# EasyEDA schematic SCH_USB-HUB_2026-07-22.json
TITLE: Sheet_1; REV: 1.0; Date: 2026-06-09; Sheet: 1/1; Drawn By: yash2942012; Company: Your Company
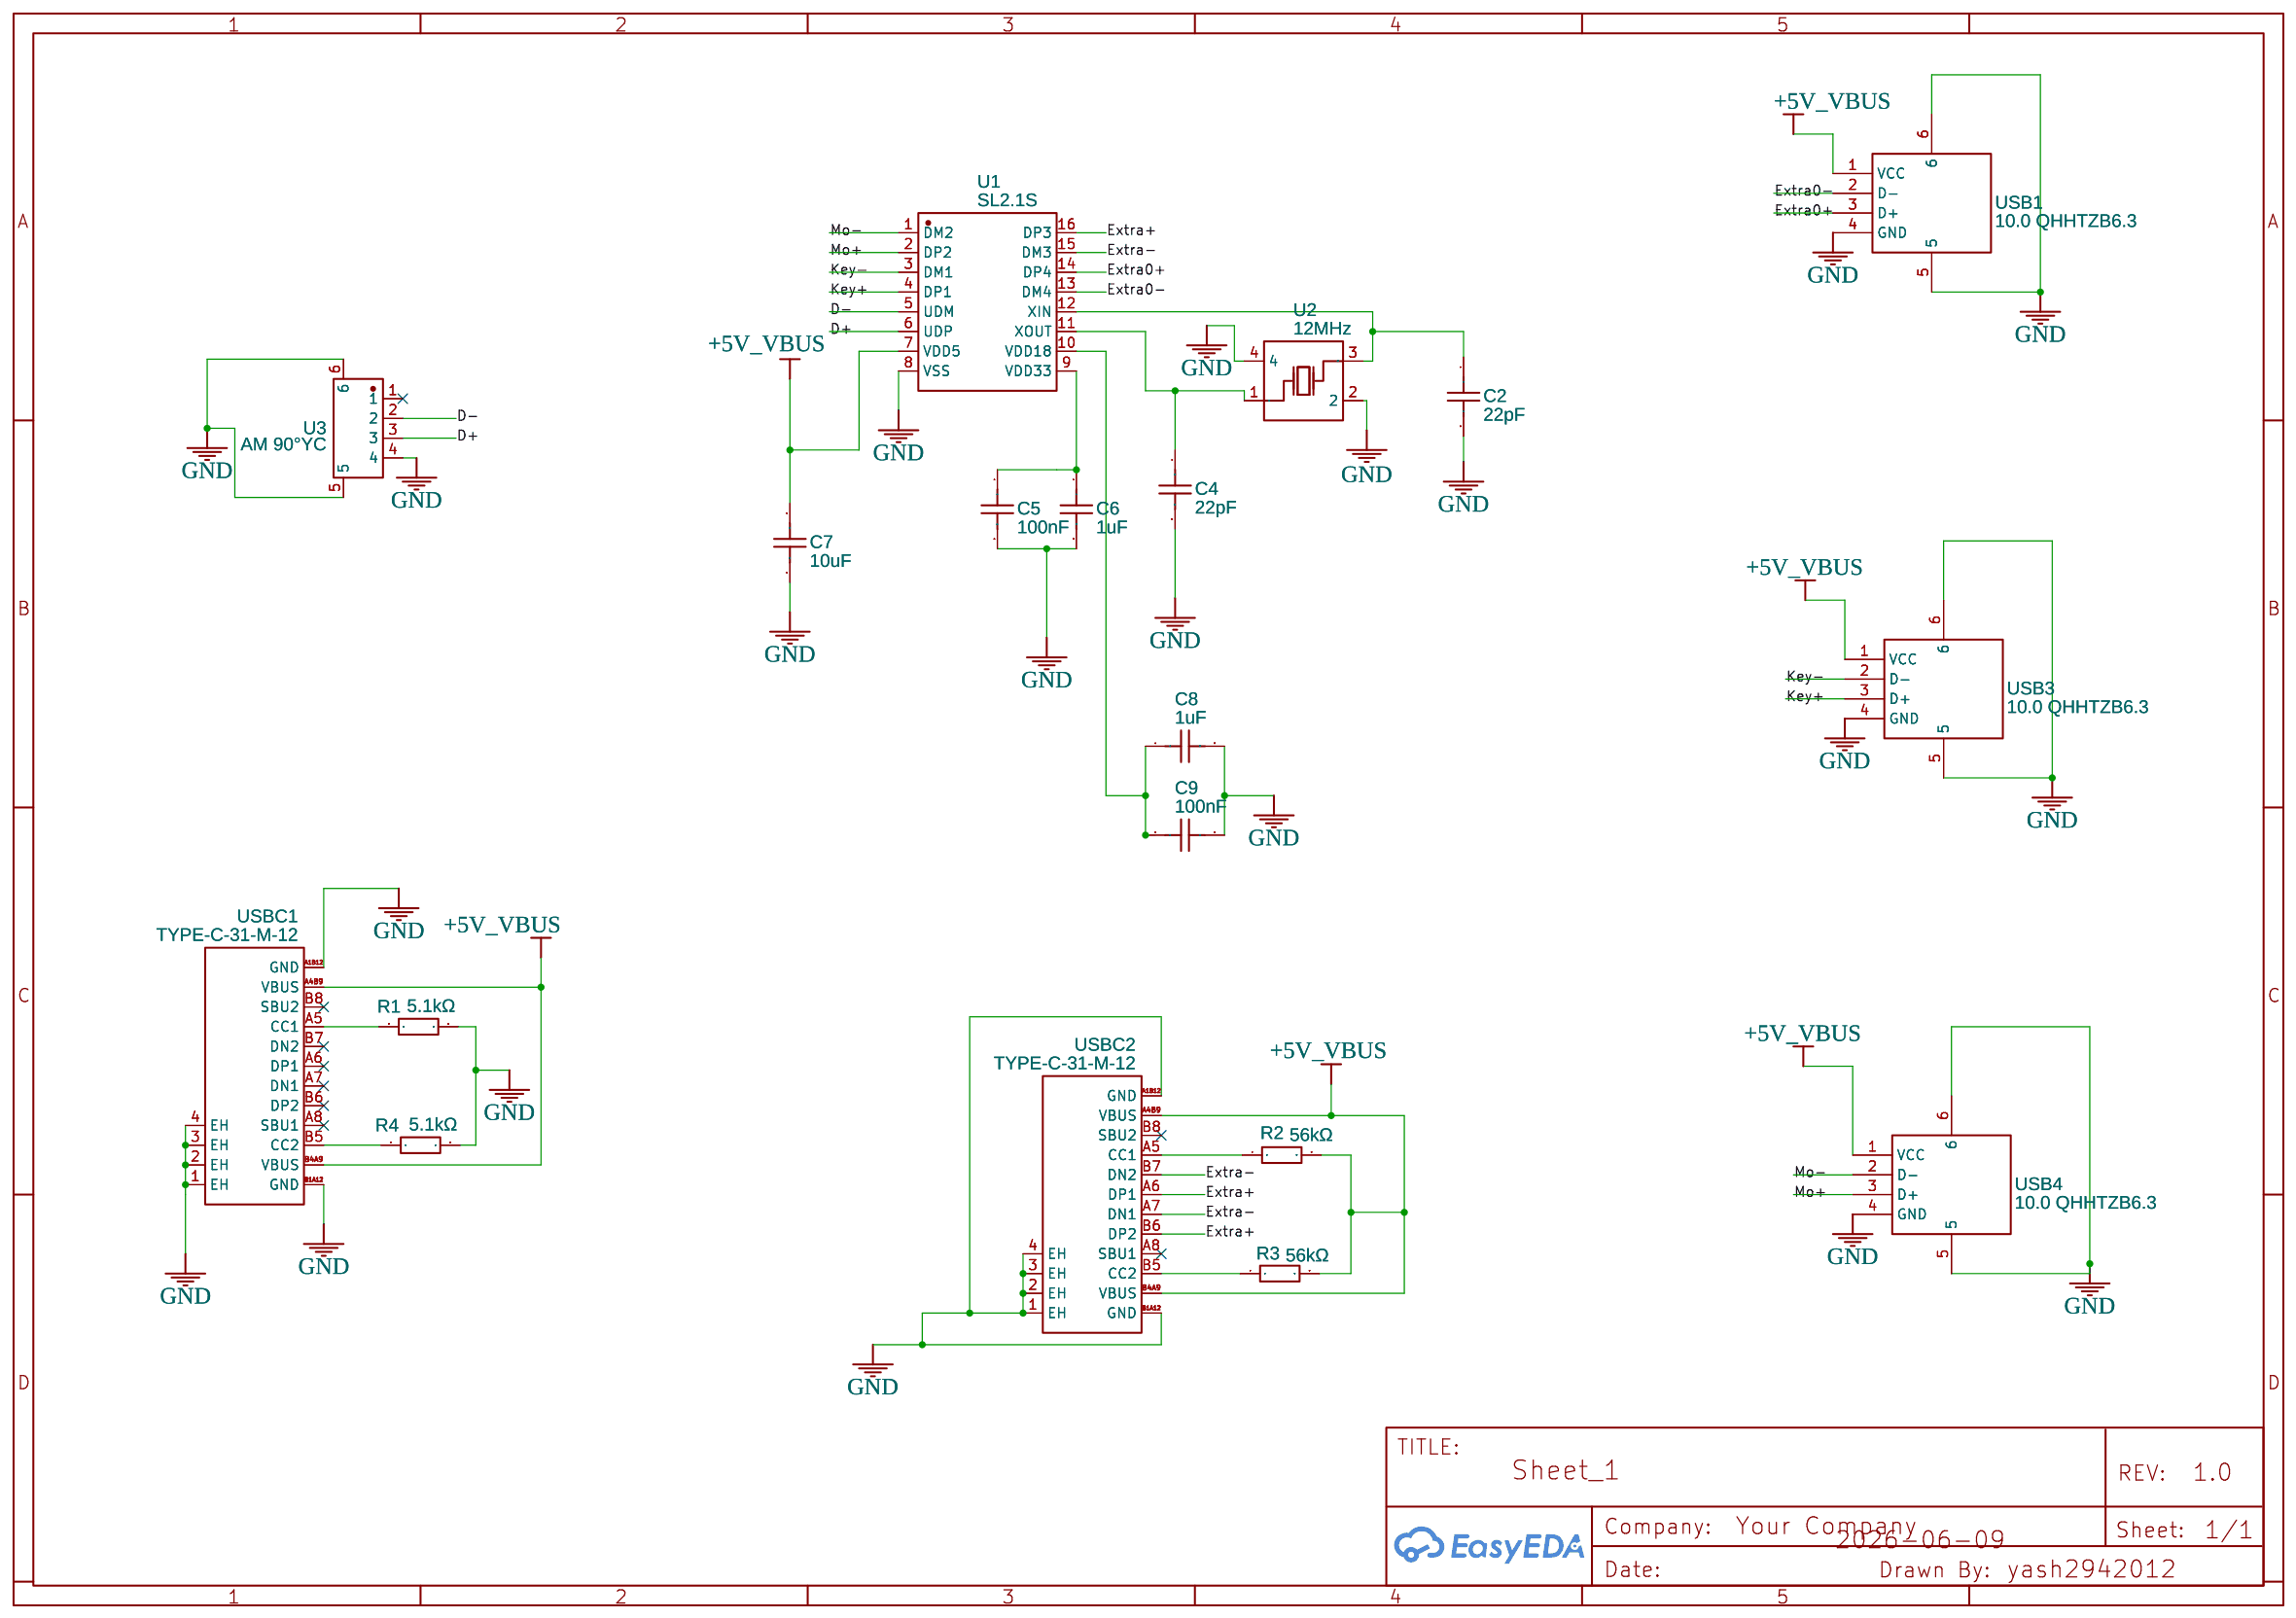
[diagram p0: schematic sheet]

## Parts
C2  22pF  [C0603]
C4  22pF  [C0603]
C5  100nF  [C0402]
C6  1uF  [C0805]
C7  10uF  [C0805]
C8  1uF  [C0805]
C9  100nF  [C0402]
R1  5.1kΩ  [R0402]
R2  56kΩ  [R0402]
R3  56kΩ  [R0402]
R4  5.1kΩ  [R0402]
U1  SL2.1S  [SSOP-16_L4.6-W2.6-P0.53-LS4.0-BL]
U2  12MHz  [CRYSTAL-SMD_4P-L2.5-W2.0-BL_XTAL12MHZ]
U3  AM 90°YC  [USB-A-SMD_AM-90-YC]
USB1  10.0 QHHTZB6.3  [USB-A-TH_10.0QHHTZB6.3]
USB3  10.0 QHHTZB6.3  [USB-A-TH_10.0QHHTZB6.3]
USB4  10.0 QHHTZB6.3  [USB-A-TH_10.0QHHTZB6.3]
USBC1  TYPE-C-31-M-12  [USB-C_SMD-TYPE-C-31-M-12_1]
USBC2  TYPE-C-31-M-12  [USB-C_SMD-TYPE-C-31-M-12_1]

## Library data of the parts
C2 C4 = CC0603KRNPO9BN220: Supplier: LCSC; Supplier Part: C1845619; Manufacturer: YAGEO(国巨); JLCPCB Part Class: Extended Part; Contributor: lcsc
C5 C9 = CL05B104KO5NNNC: Supplier: LCSC; Manufacturer: SAMSUNG(三星); Supplier Part: C1525; JLCPCB Part Class: Basic Part
C6 C8 = CC0805KKX5R5BB105: Contributor: LCSC; Supplier: LCSC; Supplier Part: C519970; Manufacturer: YAGEO(国巨); JLCPCB Part Class: Extended Part
C7 = CC0805KKX5R5BB106: Supplier: LCSC; Supplier Part: C577001; Manufacturer: YAGEO(国巨); JLCPCB Part Class: Extended Part; Contributor: lcsc
R1 R4 = 0402WGF5101TCE: Supplier: LCSC; Manufacturer: UNI-ROYAL(厚声); Supplier Part: C25905; JLCPCB Part Class: Basic Part
R2 R3 = 0402WGF5602TCE: Supplier: LCSC; Manufacturer: UNI-ROYAL(厚声); Supplier Part: C25796; JLCPCB Part Class: Extended Part
U1 = SL2.1S: Contributor: LCSC; Supplier: LCSC; Supplier Part: C2684433; Manufacturer: CoreChips(和芯润德); Manufacturer Part: SL2.1s; JLCPCB Part Class: Extended Part
U2 = ABM10AIG-12.000MHZ-4Z-T3: Contributor: LCSC; Supplier: LCSC; Supplier Part: C1985574; Manufacturer: ABRACON; JLCPCB Part Class: Extended Part
U3 = AM 90°YC: Supplier: LCSC; Supplier Part: C6386905; Manufacturer: SHOU HAN(首韩); Manufacturer Part: AM 90 YC; JLCPCB Part Class: Extended Part; Contributor: lcsc
USB1 USB3 USB4 = 10.0 QHHTZB6.3: Contributor: LCSC; Supplier: LCSC; Supplier Part: C668591; Manufacturer: SHOU HAN(首韩); JLCPCB Part Class: Extended Part
USBC1 USBC2 = TYPE-C-31-M-12: Contributor: LCSC; Supplier: LCSC; Supplier Part: C165948; Manufacturer: 韩国韩荣; JLCPCB Part Class: Extended Part

## Nets
+5V_VBUS: C7.1 R2.2 R3.2 U1.7(VDD5) USB1.1(VCC) USB3.1(VCC) USB4.1(VCC) USBC1.A4B9(VBUS) USBC1.B4A9(VBUS) USBC2.A4B9(VBUS) USBC2.B4A9(VBUS)
GND: C2.2 C4.2 C5.2 C6.2 C7.2 C8.2 C9.2 R1.2 R4.2 U1.8(VSS) U2.2 U2.4 U3.4 U3.5 U3.6 USB1.4(GND) USB1.5 USB1.6 USB3.4(GND) USB3.5 USB3.6 USB4.4(GND) USB4.5 USB4.6 USBC1.1(EH) USBC1.2(EH) USBC1.3(EH) USBC1.4(EH) USBC1.A1B12(GND) USBC1.B1A12(GND) USBC2.1(EH) USBC2.2(EH) USBC2.3(EH) USBC2.4(EH) USBC2.A1B12(GND) USBC2.B1A12(GND)
D+: U1.6(UDP) U3.3
D-: U1.5(UDM) U3.2
Extra0+: U1.14(DP4) USB1.3(D+)
Extra0-: U1.13(DM4) USB1.2(D-)
Extra+: U1.16(DP3) USBC2.A6(DP1) USBC2.B6(DP2)
Extra-: U1.15(DM3) USBC2.A7(DN1) USBC2.B7(DN2)
Key+: U1.4(DP1) USB3.3(D+)
Key-: U1.3(DM1) USB3.2(D-)
Mo+: U1.2(DP2) USB4.3(D+)
Mo-: U1.1(DM2) USB4.2(D-)
Net-(C2-1): C2.1 U1.12(XIN) U2.3(OSC2)
Net-(C4-1): C4.1 U1.11(XOUT) U2.1(OSC1)
Net-(C5-1): C5.1 C6.1 U1.9(VDD33)
Net-(C8-1): C8.1 C9.1 U1.10(VDD18)
Net-(R1-1): R1.1 USBC1.A5(CC1)
Net-(R2-1): R2.1 USBC2.A5(CC1)
Net-(R3-1): R3.1 USBC2.B5(CC2)
Net-(R4-1): R4.1 USBC1.B5(CC2)

Not connected (* = marked no-connect by the designer): U3 1*; USBC1 A6(DP1)* A7(DN1)* A8(SBU1)* B6(DP2)* B7(DN2)* B8(SBU2)*; USBC2 A8(SBU1)* B8(SBU2)*
